# EAGLE design 0008_h_field_probe_1x3mm (EAGLE 6.1)
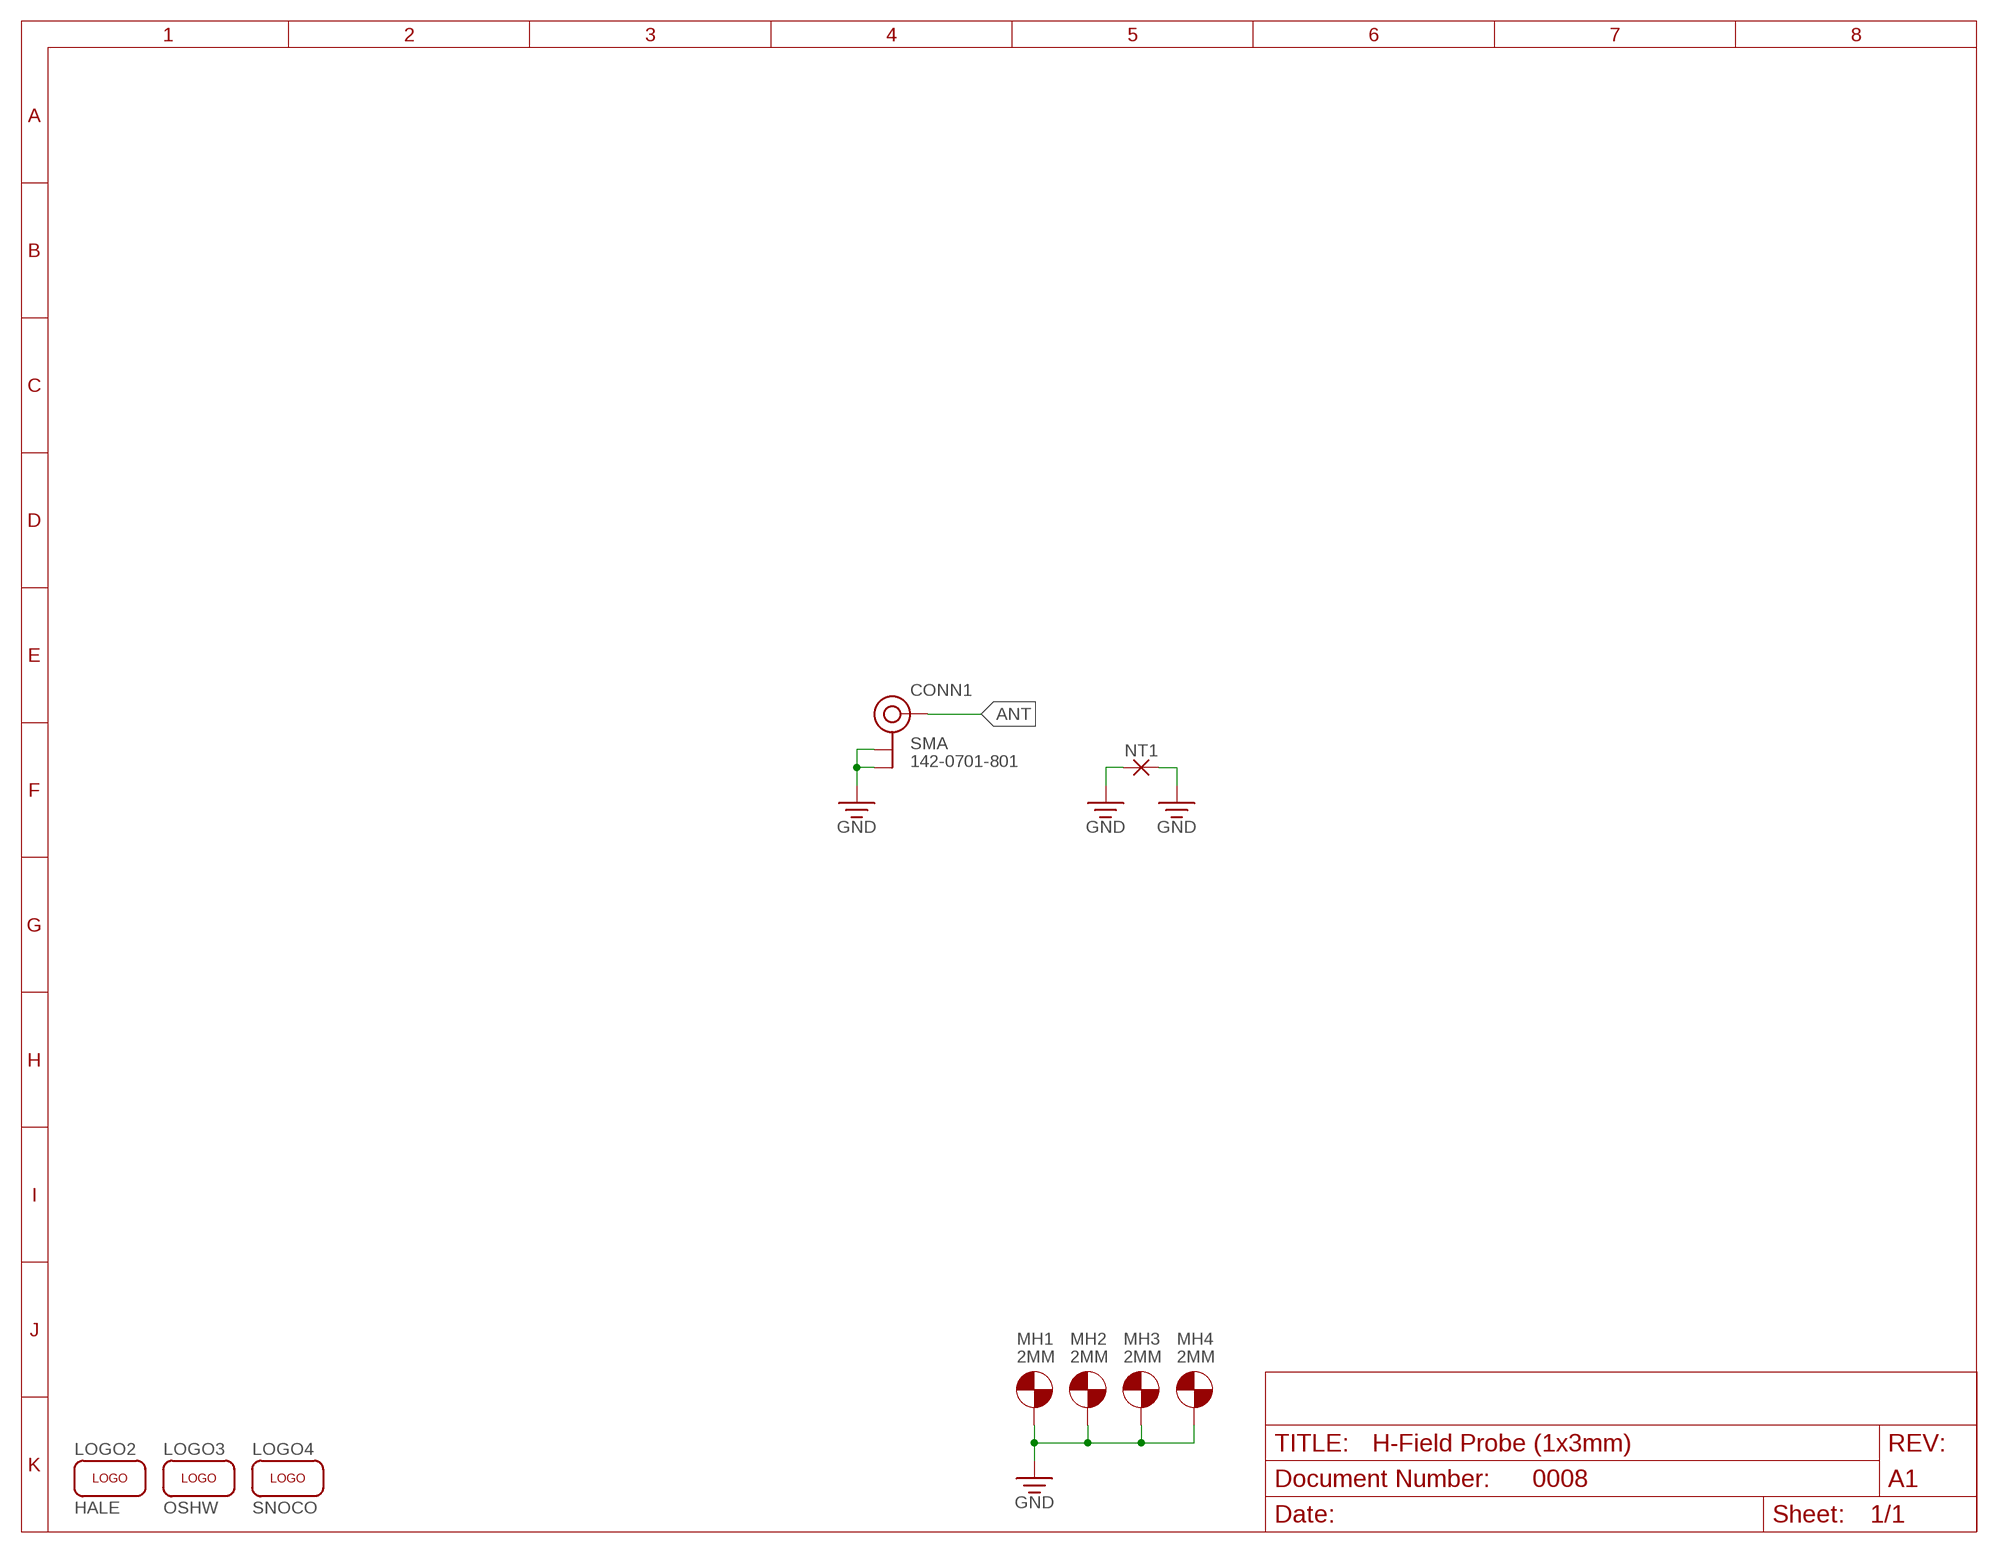
[diagram p0: schematic, sheet 1]

## Parts
CONN1  SMA  COAX-CONNECTOR-EDGE-SMA  [SMA-142-0701-801]
LOGO2  HALE  LOGO-HALE  [HALE-SILK-ICON]
LOGO3  OSHW  LOGO-OSHW  [OSHW-SILK-ICON]
LOGO4  SNOCO  LOGO-SNOCO  [SNOCO-SILK-ICON]
MH1  2MM  MH-ELEC-M2  [MH-M2-ELEC]
MH2  2MM  MH-ELEC-M2  [MH-M2-ELEC]
MH3  2MM  MH-ELEC-M2  [MH-M2-ELEC]
MH4  2MM  MH-ELEC-M2  [MH-M2-ELEC]
NT1  NETTIE-VIA-TB  [NETTIE-VIA-TB]
U$2  FRAME-8.5X11-LANDSCAPE-LET  [FRAME-8.5X11-LANDSCAPE]

## Nets
ANT: CONN1.2(SIGNAL)
GND: CONN1.1(GND) CONN1.3(GND) CONN1.4(GND) CONN1.5(GND) MH1.1 MH2.1 MH3.1 MH4.1 NT1.1 NT1.2

## Library data of the parts
CONN1 = aaa:COAX-CONNECTOR: Coax Connector; DIGIKEY: J502-ND; MFG: Cinch Connectivity Solutions Johnson; PN: 142-0701-801
LOGO2-LOGO4 = aaa:LOGO
MH1-MH4 = aaa:MH-ELEC: Electrically Connected Mounting Hole
NT1 = aaa:NETTIE
U$2 = aaa:FRAME-8.5X11-LANDSCAPE; DOCNUM: 0008; REV: A1; TITLE: H-Field Probe (1x3mm)

## Board
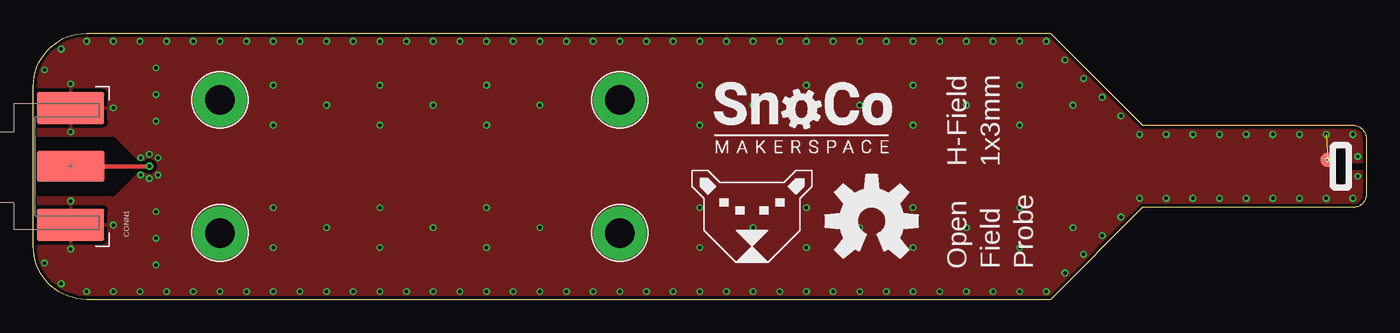
[diagram p1: board, top side]
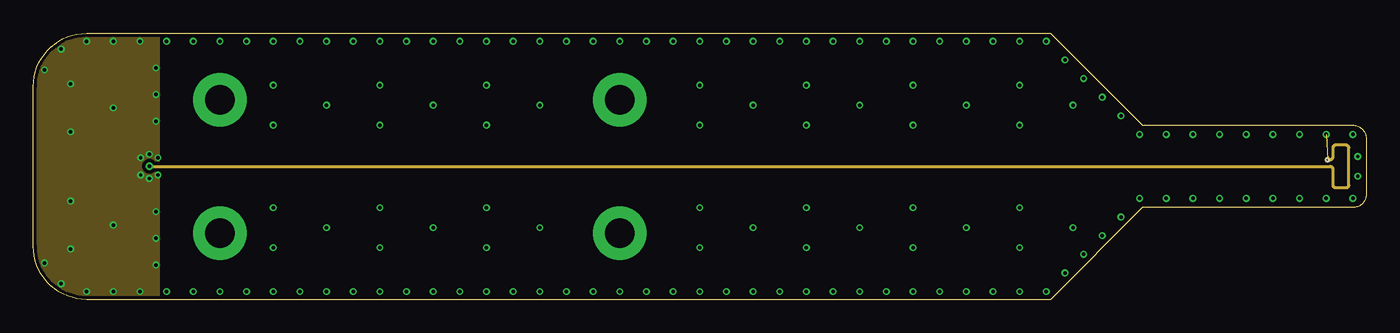
[diagram p2: board, inner layer Route2]
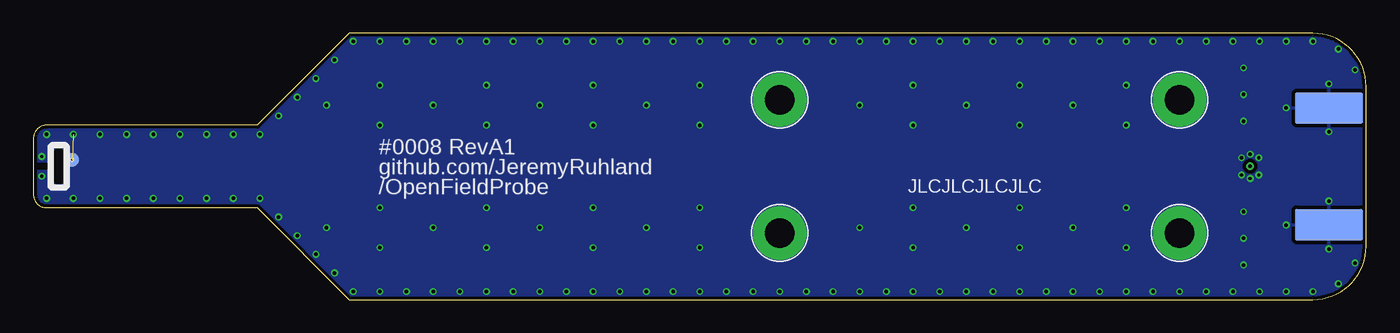
[diagram p3: board, bottom side, seen from below]

Size 100 x 20 mm. Coordinates in mm from the lower left corner, seen from the top.
Outline: 76.3,0 4,0 arc-90 0,4 0,16 arc-90 4,20 76.3,20 83.2,13.1 99,13.1 arc-90 100,12.1 100,7.9 arc-90 99,6.9 92.6,6.9 83.2,6.9 76.3,0
Copper layers (1+2*3+16): Top 0.035mm / dielectric 0.2mm / Route2 0.0175mm / dielectric 1.065mm / Route3 0.0175mm / dielectric 0.2mm / Bottom 0.035mm
Design rules: minimum track width 3.5mil, minimum drill 0.2mm, track to track 3.5mil, track to pad 3.5mil, pad to pad 3.5mil, via to via 0.5mm, smd to smd 3.5mil, copper to edge 0.2mm, drill to drill 10mil, minimum pad ring 0.125mm, minimum via ring 0.125mm, stop-mask expansion 0.05mm, vias tented up to drill 999mil, thermal gap 10mil
tRestrict: 11 lines
bRestrict: 5 lines

### Footprints (pad centres in the part's own frame; a part is rotated, then mirrored left to right if it is on the bottom)
SMA-142-0701-801 = smd 2.413 x 5.08: 1 -4.381,0; 3 4.381,0 | smd 2.286 x 5.08: 2 0,0 | smd 2.413 x 5.08 bottom: 4 -4.381,0; 5 4.381,0
MH-M2-ELEC = drill 2.2 pad 4: 1 0,0
NETTIE-VIA-TB = smd 1 x 1: 1 0,0 | smd 1 x 1 bottom: 2 0,0 | hole 0.254: 0,0

### Placement (x,y rotation side)
CONN1  2.8,10 90 top
LOGO2  53.9,4 0 top
LOGO3  62.9,5.9 0 top
LOGO4  57.7,13.7 0 top
MH1  14,5 0 top
MH2  44,5 0 top
MH3  44,15 0 top
MH4  14,15 0 top
NT1  97.1,10.5 0 top
U$2  -36,-60 0 top  (outside the outline)

### Tracks (layer width: path | path; a pad name or v marks a point on that pad's centre or on a via)
ANT  (via drill 0.25 pad 0.57)
  Top 0.353: CONN1.2 v8.7,10
  Route2 0.235: v8.7,10 97.3,10 arc-90 97.5,9.8 97.5,8.6 arc90 97.7,8.4 98.5,8.4 arc90 98.7,8.6 98.7,11.4 arc90 98.5,11.6 97.7,11.6 arc90 97.5,11.4 97.5,10.7 arc-90 97.3,10.5
GND  (via drill 0.25 pad 0.41)  (3 unrouted)
  Route2 0.235: NT1.2 97.3,10.5
  other vias: 6,0.6 8,0.6 10,0.6 12,0.6 14,0.6 16,0.6 18,0.6 20,0.6 22,0.6 24,0.6 26,0.6 28,0.6 30,0.6 32,0.6 34,0.6 36,0.6 38,0.6 40,0.6 42,0.6 44,0.6 46,0.6 48,0.6 50,0.6 52,0.6 54,0.6 56,0.6 58,0.6 60,0.6 62,0.6 64,0.6 66,0.6 68,0.6 70,0.6 72,0.6 74,0.6 76,0.6 85,7.6 87,7.6 89,7.6 91,7.6 93,7.6 95,7.6 97,7.6 4,19.4 6,19.4 8,19.4 10,19.4 12,19.4 14,19.4 16,19.4 18,19.4 20,19.4 22,19.4 24,19.4 26,19.4 28,19.4 30,19.4 32,19.4 34,19.4 36,19.4 38,19.4 40,19.4 42,19.4 44,19.4 46,19.4 48,19.4 50,19.4 52,19.4 54,19.4 56,19.4 58,19.4 60,19.4 62,19.4 64,19.4 66,19.4 68,19.4 70,19.4 72,19.4 74,19.4 76,19.4 85,12.4 87,12.4 89,12.4 91,12.4 93,12.4 95,12.4 97,12.4 9.2,17.4 9.2,15.4 9.2,13.4 8.7,10.91 9.2,2.6 9.2,4.6 9.2,6.6 8.7,9.09 99.37,10.74 99.37,9.26 8.06,9.36 9.34,10.64 9.34,9.36 8.06,10.64 2.8,12.6 2.8,7.4 6,5.6 6,14.4 2.8,3.8 2.8,16.2 4,0.6 2.09,1.19 0.84,2.75 2.09,18.81 0.84,17.25 18,16.1 18,13.1 18,3.9 18,6.9 26,16.1 26,13.1 26,3.9 26,6.9 34,16.1 34,13.1 34,3.9 34,6.9 50,16.1 50,13.1 50,3.9 50,6.9 58,16.1 58,13.1 58,3.9 58,6.9 66,16.1 66,13.1 66,3.9 66,6.9 74,16.1 74,13.1 74,3.9 74,6.9 22,5.4 22,14.6 30,5.4 30,14.6 38,5.4 38,14.6 54,5.4 54,14.6 62,5.4 62,14.6 70,5.4 70,14.6 78,5.4 78,14.6 77.4,2 78.8,3.4 80.2,4.8 81.6,6.2 83,7.6 77.4,18 78.8,16.6 80.2,15.2 81.6,13.8 83,12.4 99,12.4 99,7.6
  pour Top (isolate 0.254): 0,20 100,20 100,0 0,0
  pour Bottom (isolate 0.254): 0,20 100,20 100,0 0,0
  pour Route2 (isolate 0.254): 0,20 0,0 9.4,0 9.4,20
(copper drawn outside any net)
  shapes: Route2 circle x1

### Text on the board
Document: Notes: | 1. | Top/component side shown. | Dimension in MM unless otherwise specified. | 2. | Fabricate PCB in accordance with IPC-6012 Class 2. | 3. | Registration: Hole position shall be within 0.2032mm | (8mil) of true position. | Layer registration shall be within 0.127mm (5mil) of true | position. | 4. | Drills: All holes shall have a tolerance of +0.13/-0.08mm | (5.1/3.15mil). | All regions labled "CUTOUT" shall be removed (NPTH) | 5. | Material: FR-4 laminate and prepreg per IPC-4101/21. | 0.035mm (1oz) (1.38mil) copper exterior layers. | 0.0175mm (1/2oz) (0.69mil) copper interior layers. | Board thickness shall be 1.5748mm (62mil) +/-0.254mm (10mil). | 6. | Finish: All exposed conductive pattern areas shall be | plated by HASL. | Apply solder mask (green) per IPC-SM-840 Class T to both | sides over bare copper. | Via holes shall not be plugged. | 7. | Silkscreen: White, both sides per MIL-I-43553. | Not to be printed on exposed conductive pattern areas. | Manufacturer identification codes shall not be printed on | top layer of PCB. | # | Name | File | Notes | 1 | Top Stencil | .GTP | 2 | Top Silk | .GTO | 3 | Top Solder Mask | .GTS | 4 | Top Layer | .GTL | 5 | Layer 2 | .G2L | 6 | Layer 3 | .G3L | 7 | Bottom Layer | .GBL | 8 | Bottom Solder Mask | .GBS | 9 | Bottom Silk | .GBO | 10 | Bottom Stencil | .GBP | 11 | Board Outline | .GKO | 12 | Plated Drills | .XLN | 13 | Drill Drawing | .GD1 | 14 | Documentation | .GD2
tSilk: H-Field | 1x3mm | Open | Field | Probe
bSilk: #0008 RevA1 | github.com/JeremyRuhland | JLCJLCJLCJLC | /OpenFieldProbe